# Altium schematic sheet Sheet1.SchDoc
size 840 x 594 mm; SheetTotal: 1; DocumentType: Схема электрическая принципиальная
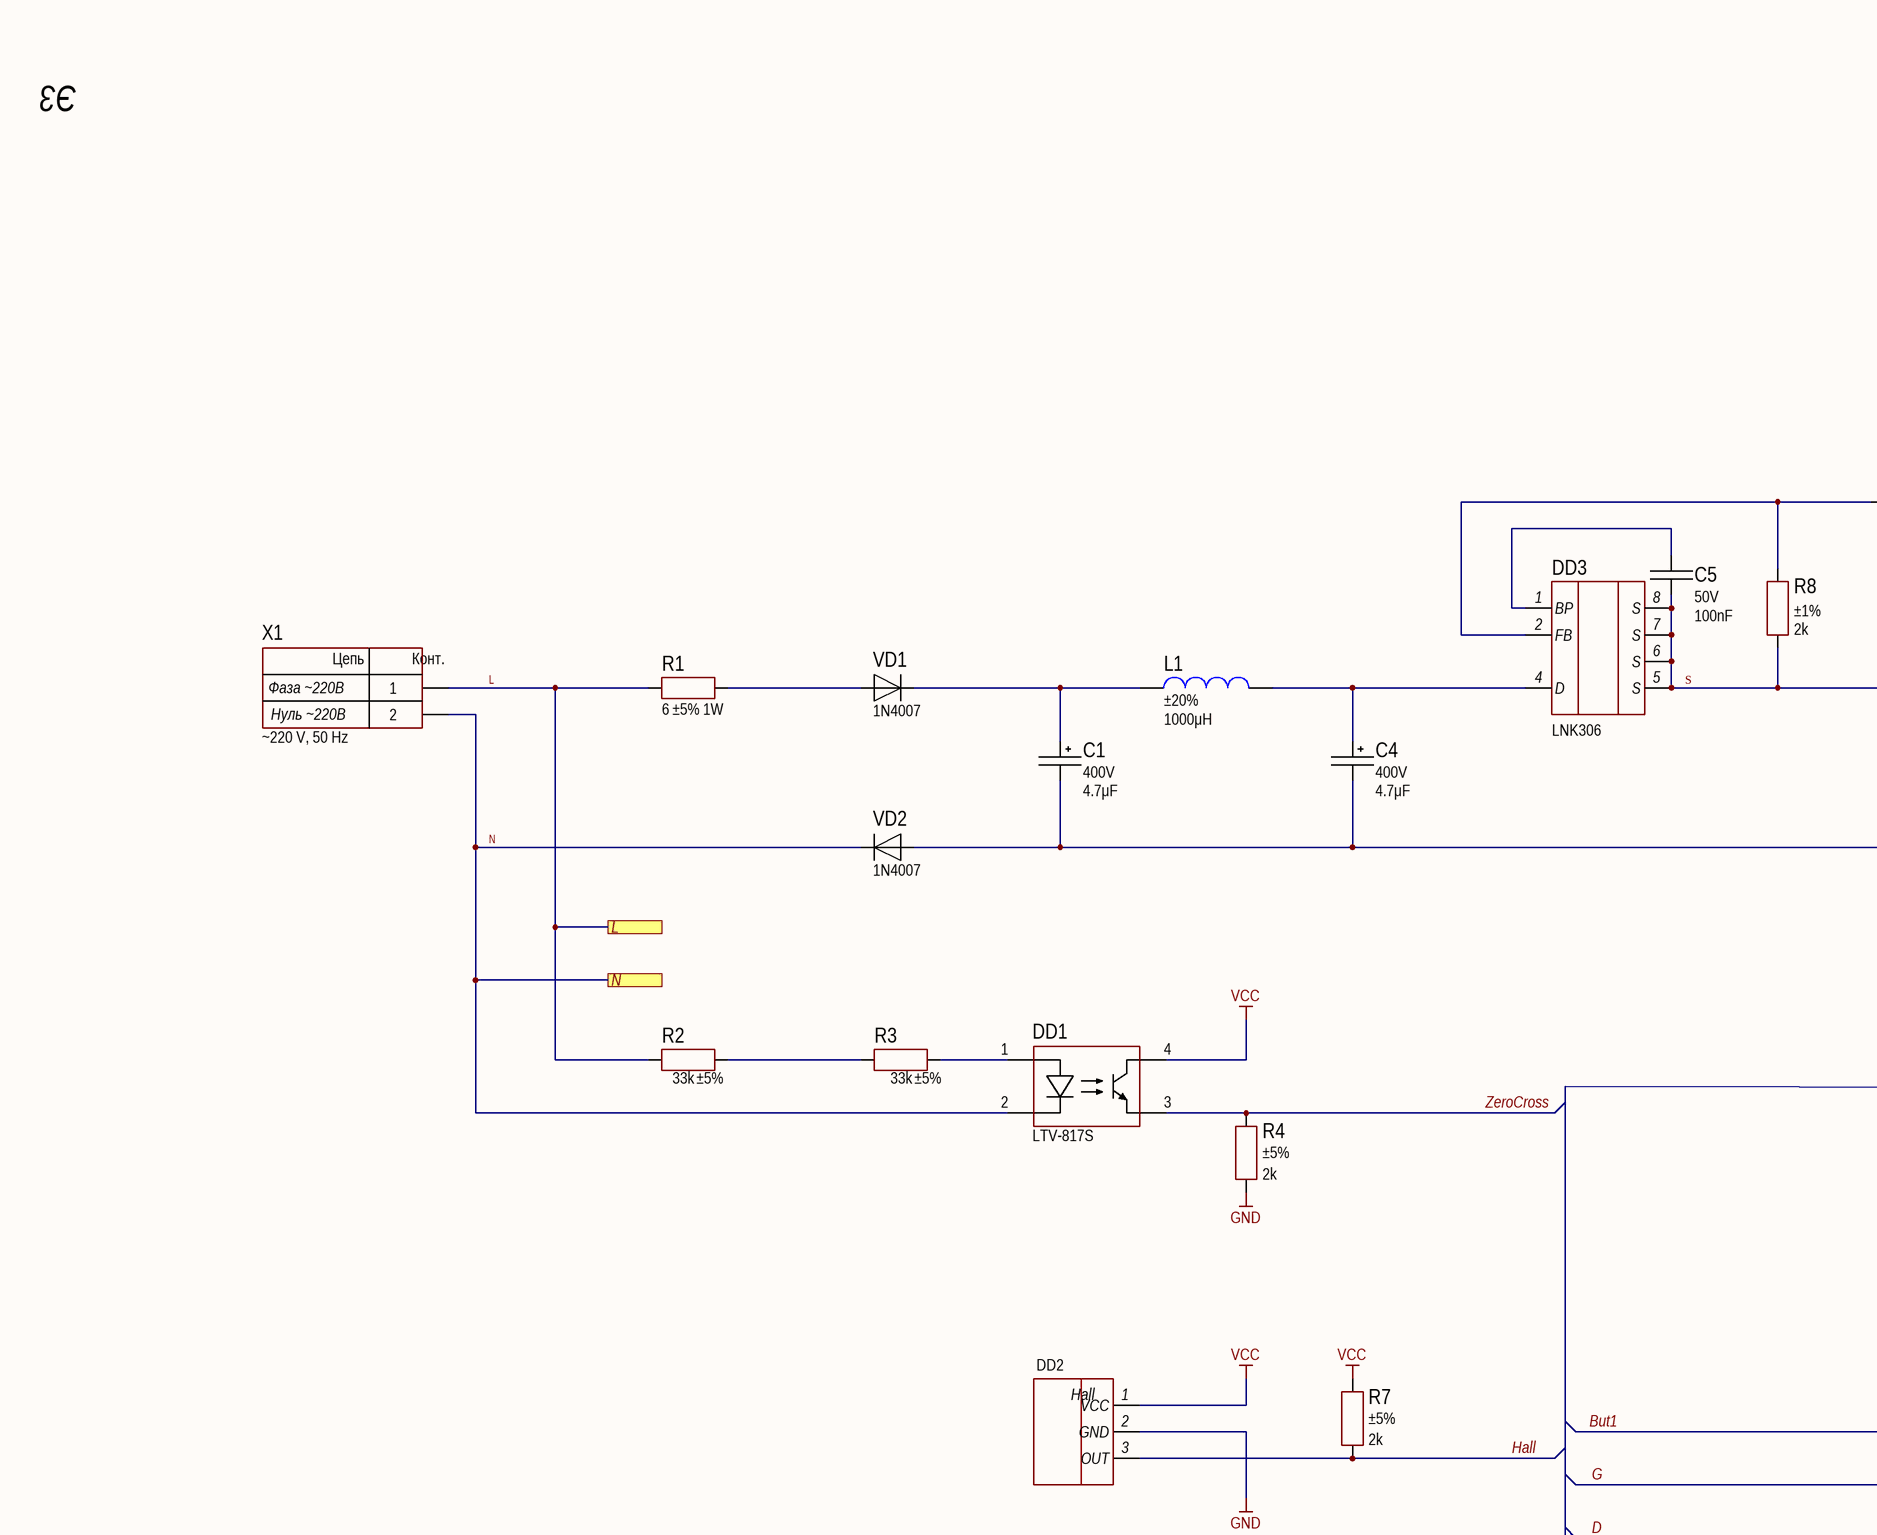
[diagram p0: Sheet1.SchDoc, top left]
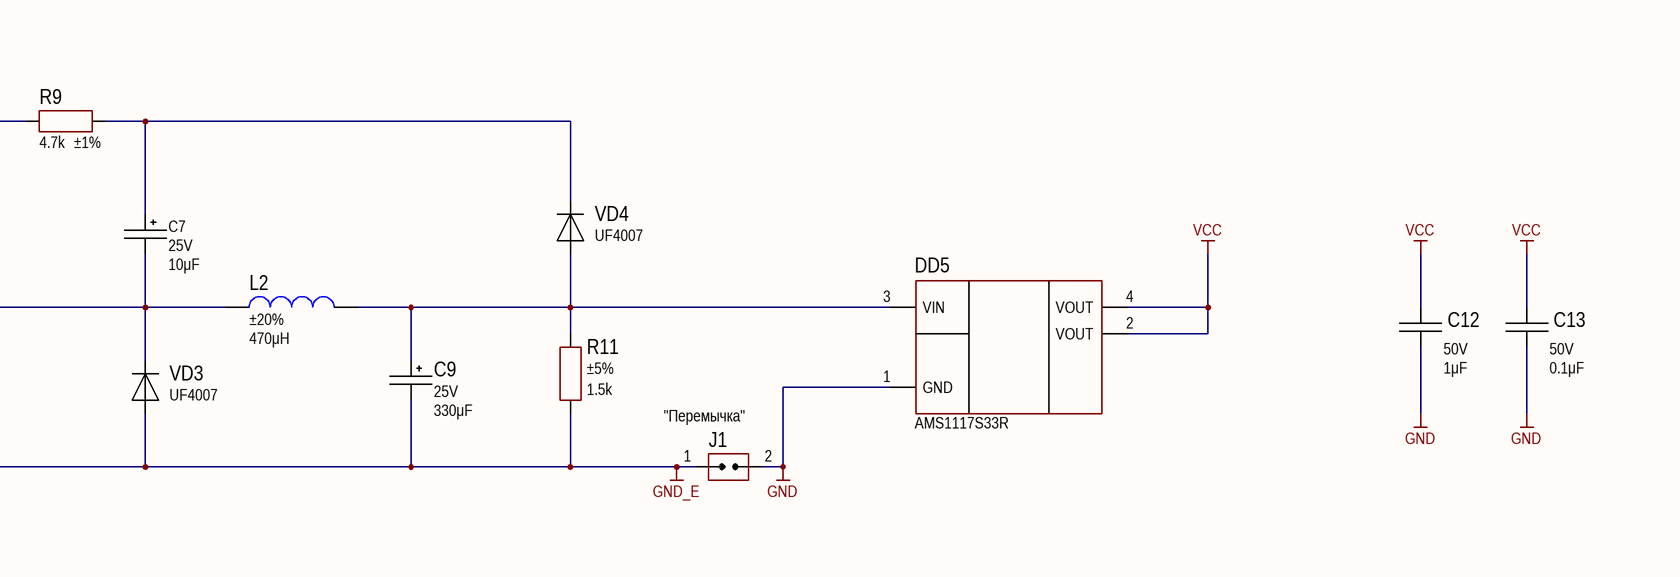
[diagram p1: Sheet1.SchDoc, top right]
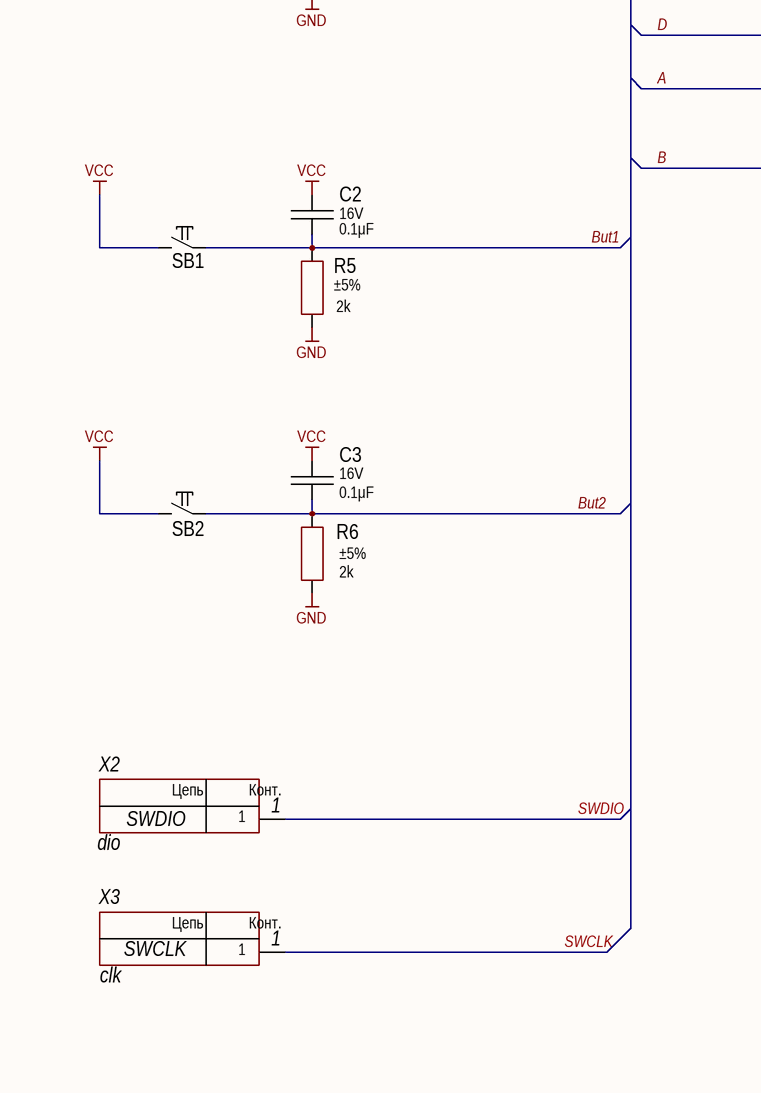
[diagram p2: Sheet1.SchDoc, bottom left]
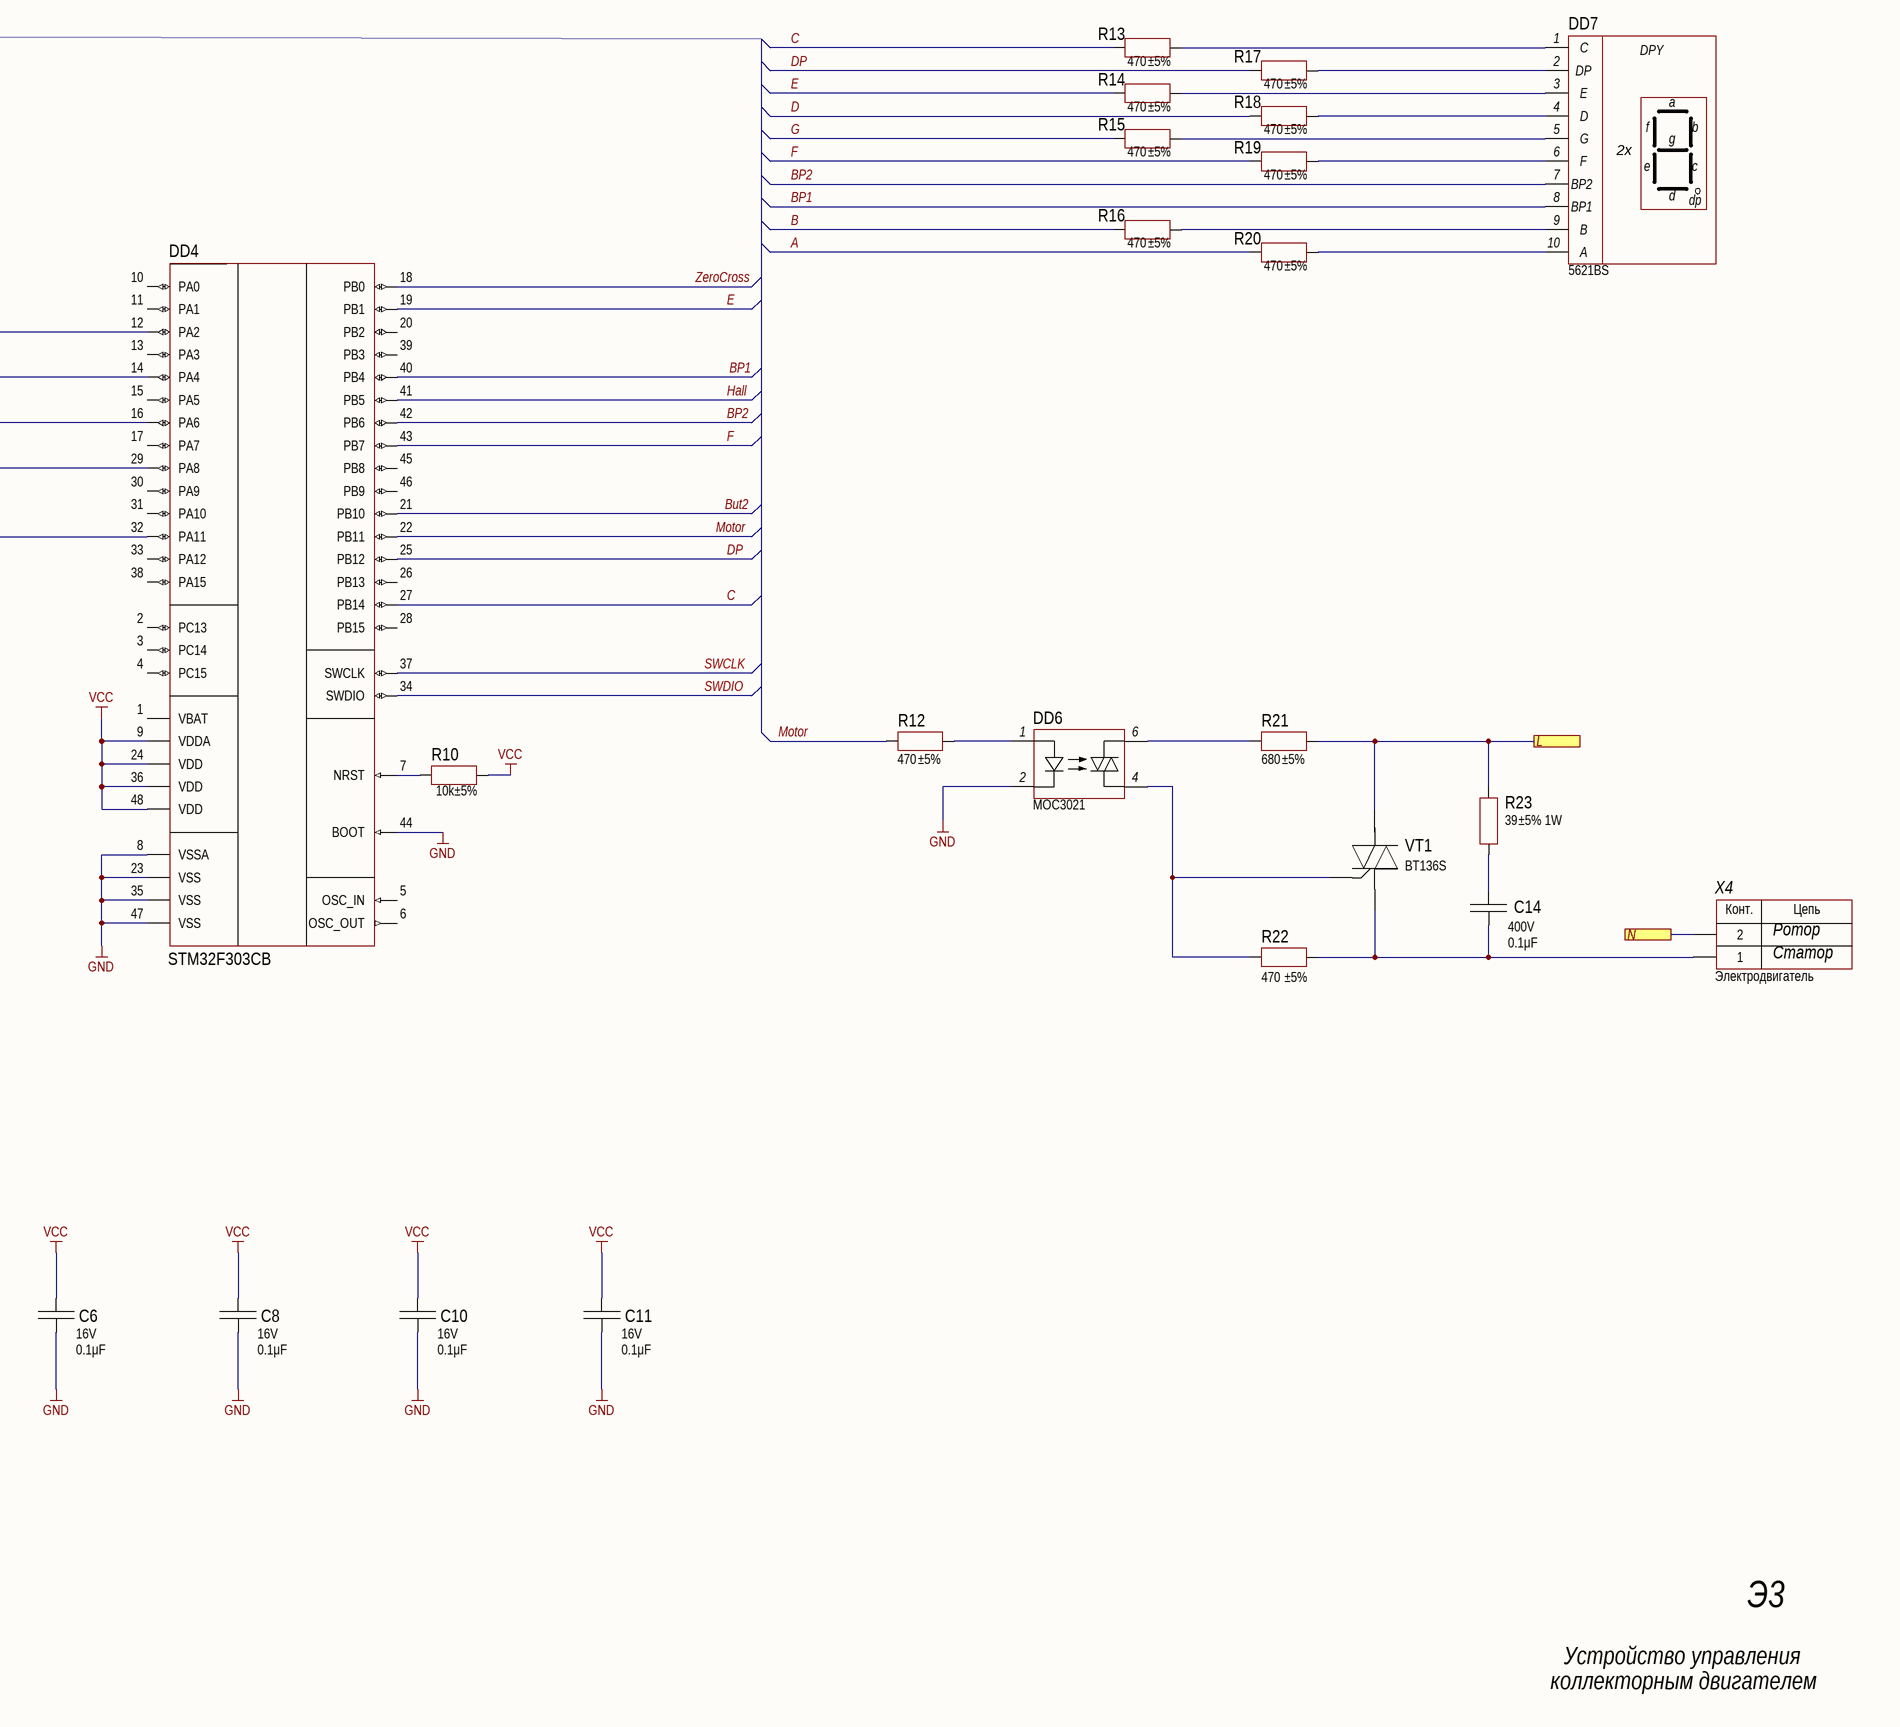
[diagram p3: Sheet1.SchDoc, bottom right]

## Parts
C1  value 4.7μF  Voltage: 400V  [CAP: D8C3.5H12]
C2  value 0.1μF  Voltage: 16V  [CAP: 0805]
C3  value 0.1μF  Voltage: 16V  [CAP: 0805]
C4  value 4.7μF  Voltage: 400V  [CAP: D8C3.5H12]
C5  value 100nF  Voltage: 50V  [CAP: 1206]
C6  value 0.1μF  Voltage: 16V  [CAP: 0805]
C7  value 10μF  Voltage: 25V  [CAP: D5C2H11]
C8  value 0.1μF  Voltage: 16V  [CAP: 0805]
C9  value 330μF  Voltage: 25V  [CAP: D10C5H12.5]
C10  value 0.1μF  Voltage: 16V  [CAP: 0805]
C11  value 0.1μF  Voltage: 16V  [CAP: 0805]
C12  value 1μF  Voltage: 50V  [CAP: 1206]
C13  value 0.1μF  Voltage: 50V  [CAP: 1206]
C14  value 0.1μF  Voltage: 400V  [CAP: B32521]
DD1  PartNumber: LTV-817S  [4-SMD]
DD2  A3144 Hall  [hall]  (value not drawn)
DD3  LNK306  [SO-8C]
DD4  PartNumber: STM32F303CB  [48-LQFP]
DD5  PartNumber: AMS1117S33R  [SOT223]
DD6  MOC3021  [SDIP-6]
DD7  5621BS  [0.56"]
J1  CommentText: "Перемычка"  [CON: JUMPER x1]
L1  value 1000μH  Tolerance: ±20%  [IND: SDR0604]
L2  value 470μH  Tolerance: ±20%  [IND: SDR0604]
R1  value 6  Tolerance: ±5% 1W  [RES: 2512]
R2  value 33k  Tolerance: ±5%  [RES: 1206]
R3  value 33k  Tolerance: ±5%  [RES: 1206]
R4  value 2k  Tolerance: ±5%  [RES: 0805]
R5  value 2k  Tolerance: ±5%  [RES: 0805]
R6  value 2k  Tolerance: ±5%  [RES: 0805]
R7  value 2k  Tolerance: ±5%  [RES: 0805]
R8  value 2k  Tolerance: ±1%  [RES: 1206]
R9  value 4.7k  Tolerance: ±1%  [RES: 1206]
R10  value 10k  Tolerance: ±5%  [RES: 0402]
R11  value 1.5k  Tolerance: ±5%  [RES: 1206]
R12  value 470  Tolerance: ±5%  [RES: 0805]
R13  value 470  Tolerance: ±5%  [RES: 0805]
R14  value 470  Tolerance: ±5%  [RES: 0805]
R15  value 470  Tolerance: ±5%  [RES: 0805]
R16  value 470  Tolerance: ±5%  [RES: 0805]
R17  value 470  Tolerance: ±5%  [RES: 0805]
R18  value 470  Tolerance: ±5%  [RES: 0805]
R19  value 470  Tolerance: ±5%  [RES: 0805]
R20  value 470  Tolerance: ±5%  [RES: 0805]
R21  value 680  Tolerance: ±5%  [RES: 1206]
R22  value 470  Tolerance: ±5%  [RES: 1206]
R23  value 39  Tolerance: ±5% 1W  [RES: 2512]
SB1  (no value)  [Button_smd 6x4]
SB2  (no value)  [Button_smd 6x4]
VD1  PartNumber: 1N4007  [DIODE: SMA]
VD2  PartNumber: 1N4007  [DIODE: SMA]
VD3  PartNumber: UF4007  [DIODE: SMA]
VD4  PartNumber: UF4007  [DIODE: SMA]
VT1  BT136S  [TO-252]
X1  CommentText: ~220 V, 50 Hz  [CON: 0395430002 (5 mm)]
X2  dio  [1-PIN]
X3  clk  [1-PIN]
X4  CommentText: Электродвигатель  [CON: 0395430002 (5 mm)]

## Ports
L, N

## Nets
GND: C6.1 C8.1 C10.1 C11.1 C12.1 C13.1 DD2.2(GND) DD4.8(VSSA) DD4.23(VSS) DD4.35(VSS) DD4.44(BOOT) DD4.47(VSS) DD5.1(GND) DD6.2(C) J1.2(IN) R4.1 R5.2 R6.1
GND_E: C1.2 C4.2 C9.2 J1.1(IN) R11.2 VD2.1 VD3.1
VCC: C2.1 C3.1 C6.2 C8.2 C10.2 C11.2 C12.2 C13.2 DD1.4(C) DD2.1(VCC) DD4.9(VDDA) DD4.24(VDD) DD4.36(VDD) DD4.48(VDD) DD5.2(VOUT) DD5.4(VOUT) R7.2 R10.2 SB1.2 SB2.2
A: DD4.29(PA8) R20.1
B: DD4.32(PA11) R16.1
BP1: DD4.40(PB4) DD7.8(BP1)
BP2: DD4.42(PB6) DD7.7(BP2)
But1: C2.2 DD4.12(PA2) R5.1 SB1.1
But2: C3.2 DD4.21(PB10) R6.2 SB2.1
C: DD4.27(PB14) R13.1
D: DD4.16(PA6) R18.1
DP: DD4.25(PB12) R17.1
E: DD4.19(PB1) R14.1
F: DD4.43(PB7) R19.1
G: DD4.14(PA4) R15.1
Hall: DD2.3(OUT) DD4.41(PB5) R7.1
L: R1.1 R2.1 R21.1 R23.2 VT1.2(T2) X1.1 ; port L
Motor: DD4.22(PB11) R12.1
N: DD1.2(C) VD2.2 X1.2 X4.2 ; port N
S: C5.1 C7.2 DD3.5(S) DD3.6(S) DD3.7(S) DD3.8(S) L2.2 R8.1 VD3.2
SWCLK: DD4.37(SWCLK) X3.1
SWDIO: DD4.34(SWDIO) X2.1
ZeroCross: DD1.3(E) DD4.18(PB0) R4.2
NetC1_1: C1.1 L1.2 VD1.2
NetC4_1: C4.1 DD3.4(D) L1.1
NetC5_2: C5.2 DD3.1(BP)
NetC7_1: C7.1 R9.2 VD4.2
NetC9_1: C9.1 DD5.3(VIN) L2.1 R11.1 VD4.1
NetC14_1: C14.1 R23.1
NetC14_2: C14.2 R22.1 VT1.1(T1) X4.1
NetDD1_1: DD1.1(A) R3.2
NetDD3_2: DD3.2(FB) R8.2 R9.1
NetDD4_7: DD4.7(NRST) R10.1
NetDD6_1: DD6.1(A) R12.2
NetDD6_4: DD6.4(OUT2) R22.2 VT1.3(G)
NetDD6_6: DD6.6(OUT1) R21.2
NetDD7_1: DD7.1(C) R13.2
NetDD7_2: DD7.2(DP) R17.2
NetDD7_3: DD7.3(E) R14.2
NetDD7_4: DD7.4(D) R18.2
NetDD7_5: DD7.5(G) R15.2
NetDD7_6: DD7.6(F) R19.2
NetDD7_9: DD7.9(B) R16.2
NetDD7_10: DD7.10(A) R20.2
NetR1_2: R1.2 VD1.1
NetR2_2: R2.2 R3.1

Not connected (* = marked no-connect by the designer): DD4 1(VBAT) 2(PC13) 3(PC14) 4(PC15) 5(OSC_IN) 6(OSC_OUT) 10(PA0) 11(PA1) 13(PA3) 15(PA5) 17(PA7) 20(PB2) 26(PB13) 28(PB15) 30(PA9) 31(PA10) 33(PA12) 38(PA15) 39(PB3) 45(PB8) 46(PB9)

## Notes on the sheet
- Э3
- Фаза ~220В
- Нуль ~220В
- Ротор
- Статор
- SWDIO
- SWCLK
- Устройство управления
- коллекторным двигателем
- Перв. примен.
- Справ. №
- Подп. и дата
- Инв. № дубл.
- Взам. инв. №
- Разраб.
- Изм.
- Лист
- № докум.
- Подп.
- Дата
- Лит.
- Масса
- Масштаб
- Пров.
- Т.контр.
- Листов
- Инв. № подл.
- Утв.
- Н.контр.
- 2.106-A1
- Копировал
- Формат А1
- (in symbol 1-PIN) Цепь; Конт.
- (in symbol 7-segment 2 digit display) DPY; a; f; b; g; 2x; e; c; d; dp
- (in symbol A3144 Hall) Hall
- (in symbol Connector_terminal_2pin) Цепь; Конт.

## Library data of the parts
C1 C4 = Aluminium: Manufacturer: Wurth; PartNumber: 860080475013; ValueManufacturerPartNumber: Aluminium capacitor, 4.7μF, 400V, ±20%, 54mOhm, 14x10x5 mm, -55...+105°C; TypeCapacitor: Aluminium capacitor; Tolerance: ±20%; Impedance: 54mOhm; Package: 14x10x5 mm; HelpURL: https://www.digikey.com/product-detail/en/wurth-electronics-inc/860080475013/732-9029-1-ND/5728972; Temperature: -55...+105°C
C2 C3 C6 C8 C10 C11 = Ceramic_0805: Manufacturer: Yageo; PartNumber: CC0805KRX7R7BB104; ValueManufacturerPartNumber: Ceramic capacitor, 0.1μF, X7R, ±10%, 16V, 0805, -55...+125°C; TypeCapacitor: Ceramic capacitor; Tolerance: ±10%; TypeDielectric: X7R; Package: 0805; HelpURL: https://www.digikey.com/product-detail/en/yageo/CC0805KRX7R7BB104/311-1142-1-ND/303052; Temperature: -55...+125°C
C5 = Ceramic_1206: Manufacturer: Yageo; PartNumber: CC1206KRX7R9BB104; ValueManufacturerPartNumber: Ceramic capacitor, 100nF, X7R, ±10%, 50V, 1206, -55...+125°C; TypeCapacitor: Ceramic capacitor; Tolerance: ±10%; TypeDielectric: X7R; Package: 1206; HelpURL: https://www.digikey.com/product-detail/en/yageo/CC1206KRX7R9BB104/311-1179-1-ND/303089; Temperature: -55...+125°C
C7 = Aluminium: Manufacturer: Wurth; PartNumber: 860080475013; ValueManufacturerPartNumber: Aluminium capacitor, 10μF, 25V, ±20%, 54mOhm, 14x10x5 mm, -55...+105°C; TypeCapacitor: Aluminium capacitor; Tolerance: ±20%; Impedance: 54mOhm; Package: 14x10x5 mm; HelpURL: https://www.digikey.com/product-detail/en/wurth-electronics-inc/860080475013/732-9029-1-ND/5728972; Temperature: -55...+105°C
C9 = Aluminium: Manufacturer: Wurth; PartNumber: 860080475013; ValueManufacturerPartNumber: Aluminium capacitor, 330μF, 25V, ±20%, 54mOhm, 14x10x5 mm, -55...+105°C; TypeCapacitor: Aluminium capacitor; Tolerance: ±20%; Impedance: 54mOhm; Package: 14x10x5 mm; HelpURL: https://www.digikey.com/product-detail/en/wurth-electronics-inc/860080475013/732-9029-1-ND/5728972; Temperature: -55...+105°C
C12 = Ceramic_1206: Manufacturer: Yageo; PartNumber: CC1206KRX7R9BB104; ValueManufacturerPartNumber: Ceramic capacitor, 1μF, X7R, ±10%, 50V, 1206, -55...+125°C; TypeCapacitor: Ceramic capacitor; Tolerance: ±10%; TypeDielectric: X7R; Package: 1206; HelpURL: https://www.digikey.com/product-detail/en/yageo/CC1206KRX7R9BB104/311-1179-1-ND/303089; Temperature: -55...+125°C
C13 = Ceramic_1206: Manufacturer: Yageo; PartNumber: CC1206KRX7R9BB104; ValueManufacturerPartNumber: Ceramic capacitor, 0.1μF, X7R, ±10%, 50V, 1206, -55...+125°C; TypeCapacitor: Ceramic capacitor; Tolerance: ±10%; TypeDielectric: X7R; Package: 1206; HelpURL: https://www.digikey.com/product-detail/en/yageo/CC1206KRX7R9BB104/311-1179-1-ND/303089; Temperature: -55...+125°C
C14 = Film: Manufacturer: Epcos; PartNumber: B32774D4106K000; ValueManufacturerPartNumber: Film capacitor, 0.1μF, 400V, ±10%, 10.9mOhm, 31.5x15 mm, -40...+105°C; TypeCapacitor: Film capacitor; Tolerance: ±10%; Impedance: 10.9mOhm; Package: 31.5x15 mm; HelpURL: https://www.digikey.com/products/en/capacitors/film-capacitors/62?k=&pkeyword=&sv=0&pv2097=1958&sf=0&FV=fffc01ef%2C1f140000%2Cffe0003e%2Cffec6366&quantity=1&ColumnSort=1000011&page=1&stock=1&pageSize=25; Temperature: -40...+105°C
DD1 = LTV-817: Optoisolator; Manufacturer: Lite-On; ValueManufacturerPartNumber: IC optoisolator, 4µs/3µs, 5000Vrms, 35V, -40...+125°C, 4-SMD; Supply: 35V; DataRate: 4µs/3µs; Isolation: 5000Vrms; HelpURL: https://www.digikey.com/product-detail/en/lite-on-inc/LTV-817S/160-1367-5-ND/385837; Package: 4-SMD; ComponentType: IC optoisolator; Temperature: -40...+125°C
DD2 = A3144 Hall: Digital Hall sensor
DD4 = STM32F103C8T6: Cortex-M3; Manufacturer: STMicroelectronics; ValueManufacturerPartNumber: IC microcontroller, 32-Bit, Cortex-M3, 72MHz, 64KB, 20KB, 2...3.6V, -40...+85°C, 48-LQFP; Supply: 2...3.6V; Speed: 72MHz; CoreSize: 32-Bit; MemoryROM: 64KB; MemoryRAM: 20KB; HelpURL: https://www.digikey.com/product-detail/en/stmicroelectronics/STM32F103C8T6TR/497-17666-1-ND/7804402; Package: 48-LQFP; ComponentType: IC microcontroller; Temperature: -40...+85°C; CoreProcessor: Cortex-M3
DD5 = LDL1117S33R: Linear voltage regulator; Manufacturer: STMicroelectronics; ValueManufacturerPartNumber: Linear voltage regulator, input 3.9...18V, 0.6V, output 3.3V, 1.2A, -40...+85°C, SOT223; VoltageInput: input 3.9...18V; MaxDropout: 0.6V; CurrentOutput: 1.2A; VoltageOutput: output 3.3V; HelpURL: https://www.digikey.com/product-detail/en/stmicroelectronics/LDL1117S33R/497-17239-1-ND/7102079; Package: SOT223; ComponentType: Linear voltage regulator; Temperature: -40...+85°C
DD6 = MOC3021_2
DD7 = 7-segment 2 digit display
J1 = Jumper_single
L1 = Inductor_SDR0604: Manufacturer: Bourns; PartNumber: SDR0604-4R7ML; ValueManufacturerPartNumber: Fixed inductor, 1000μH, ±20%, SDR0604, 1.8A, -40...+125°C; TypeInductor: Fixed inductor; MaxCurrent: 1.8A; Package: SDR0604; HelpURL: https://www.digikey.com/product-detail/en/bourns-inc/SDR0604-4R7ML/SDR0604-4R7MLCT-ND/2352942; Temperature: -40...+125°C
L2 = Inductor_SDR0604: Manufacturer: Bourns; PartNumber: SDR0604-4R7ML; ValueManufacturerPartNumber: Fixed inductor, 470μH, ±20%, SDR0604, 1.8A, -40...+125°C; TypeInductor: Fixed inductor; MaxCurrent: 1.8A; Package: SDR0604; HelpURL: https://www.digikey.com/product-detail/en/bourns-inc/SDR0604-4R7ML/SDR0604-4R7MLCT-ND/2352942; Temperature: -40...+125°C
R1 = Resistor_2512: Manufacturer: Yageo; PartNumber: RC2512JK-07100RL; ValueManufacturerPartNumber: Resistor film, 6, ±5% 1W, 2512, 1W, -55...+125°C; TypeResistor: Resistor film; Power: 1W; Package: 2512; HelpURL: https://www.digikey.com/product-detail/en/yageo/RC2512JK-07100RL/YAG3393CT-ND/5962215; Temperature: -55...+125°C
R2 R3 = Resistor_1206: Manufacturer: Yageo; PartNumber: RC1206JR-07100RL; ValueManufacturerPartNumber: Resistor film, 33k, ±5%, 1206, 0.25W, -55...+125°C; TypeResistor: Resistor film; Power: 0.25W; Package: 1206; HelpURL: https://www.digikey.com/product-detail/en/yageo/RC1206JR-07100RL/311-100ERCT-ND/732153; Temperature: -55...+125°C
R4-R7 = Resistor_0805: Manufacturer: Yageo; PartNumber: RC0805JR-07100RL; ValueManufacturerPartNumber: Resistor film, 2k, ±5%, 0805, 0.125W, -55...+125°C; TypeResistor: Resistor film; Power: 0.125W; Package: 0805; HelpURL: https://www.digikey.com/product-detail/en/yageo/RC0805JR-07100RL/311-100ARCT-ND/731185; Temperature: -55...+125°C
R8 = Resistor_1206: Manufacturer: Yageo; PartNumber: RC1206JR-07100RL; ValueManufacturerPartNumber: Resistor film, 2k, ±1%, 1206, 0.25W, -55...+125°C; TypeResistor: Resistor film; Power: 0.25W; Package: 1206; HelpURL: https://www.digikey.com/product-detail/en/yageo/RC1206JR-07100RL/311-100ERCT-ND/732153; Temperature: -55...+125°C
R9 = Resistor_1206: Manufacturer: Yageo; PartNumber: RC1206JR-07100RL; ValueManufacturerPartNumber: Resistor film, 4.7k, ±1%, 1206, 0.25W, -55...+125°C; TypeResistor: Resistor film; Power: 0.25W; Package: 1206; HelpURL: https://www.digikey.com/product-detail/en/yageo/RC1206JR-07100RL/311-100ERCT-ND/732153; Temperature: -55...+125°C
R10 = Resistor_0402: Manufacturer: Yageo; PartNumber: RC0402JR-07100RL; ValueManufacturerPartNumber: Resistor film, 10k, ±5%, 0402, 0.063W, -55...+125°C; TypeResistor: Resistor film; Power: 0.063W; Package: 0402; HelpURL: https://www.digikey.com/product-detail/en/yageo/RC0402JR-07100RL/311-100JRCT-ND/729362; Temperature: -55...+125°C
R11 = Resistor_1206: Manufacturer: Yageo; PartNumber: RC1206JR-07100RL; ValueManufacturerPartNumber: Resistor film, 1.5k, ±5%, 1206, 0.25W, -55...+125°C; TypeResistor: Resistor film; Power: 0.25W; Package: 1206; HelpURL: https://www.digikey.com/product-detail/en/yageo/RC1206JR-07100RL/311-100ERCT-ND/732153; Temperature: -55...+125°C
R12-R20 = Resistor_0805: Manufacturer: Yageo; PartNumber: RC0805JR-07100RL; ValueManufacturerPartNumber: Resistor film, 470, ±5%, 0805, 0.125W, -55...+125°C; TypeResistor: Resistor film; Power: 0.125W; Package: 0805; HelpURL: https://www.digikey.com/product-detail/en/yageo/RC0805JR-07100RL/311-100ARCT-ND/731185; Temperature: -55...+125°C
R21 = Resistor_1206: Manufacturer: Yageo; PartNumber: RC1206JR-07100RL; ValueManufacturerPartNumber: Resistor film, 680, ±5%, 1206, 0.25W, -55...+125°C; TypeResistor: Resistor film; Power: 0.25W; Package: 1206; HelpURL: https://www.digikey.com/product-detail/en/yageo/RC1206JR-07100RL/311-100ERCT-ND/732153; Temperature: -55...+125°C
R22 = Resistor_1206: Manufacturer: Yageo; PartNumber: RC1206JR-07100RL; ValueManufacturerPartNumber: Resistor film, 470, ±5%, 1206, 0.25W, -55...+125°C; TypeResistor: Resistor film; Power: 0.25W; Package: 1206; HelpURL: https://www.digikey.com/product-detail/en/yageo/RC1206JR-07100RL/311-100ERCT-ND/732153; Temperature: -55...+125°C
R23 = Resistor_2512: Manufacturer: Yageo; PartNumber: RC2512JK-07100RL; ValueManufacturerPartNumber: Resistor film, 39, ±5% 1W, 2512, 1W, -55...+125°C; TypeResistor: Resistor film; Power: 1W; Package: 2512; HelpURL: https://www.digikey.com/product-detail/en/yageo/RC2512JK-07100RL/YAG3393CT-ND/5962215; Temperature: -55...+125°C
SB1 SB2 = Button_tactile: Manufacturer: TE Connectivity; ValueManufacturerPartNumber: Tactile button, 6x6mm; PartNumber: FSM2JSMAATR; TypeButton: Tactile button; CommentText: "Кнопка"; HelpURL: https://www.digikey.com/product-detail/en/te-connectivity-alcoswitch-switches/FSM2JSMAATR/450-1792-1-ND/3503931; Package: 6x6mm
VD1-VD4 = Diode_single: Manufacturer: Micro Commercial; ValueManufacturerPartNumber: Single diode, 75V, 150mA, 1V, 4ns, SOD-323, -55...+150°C; TypeDiode: Single diode; Voltage: 75V; Current: 150mA; VoltageDrop: 1V; RecoveryTime: 4ns; Package: SOD-323; HelpURL: https://www.digikey.com/product-detail/en/micro-commercial-co/1N4148WX-TP/1N4148WXTPMSCT-ND/717312; Temperature: -55...+150°C
VT1 = BTA136: Triac
X1 X4 = Connector_terminal_2pin: Manufacturer: Degson; ValueManufacturerPartNumber: Terminal connector, 2pin, 3.5mm, 300VAC, 10A; PartNumber: DG350-3.5-02P-14; TypeConnector: Terminal connector; VoltageMax: 300VAC; Pitch: 3.5mm; CurrentMax: 10A; Multichannel: 2pin; HelpURL: https://www.chipdip.ru/product/dg350-3.5-02p-12
X2 X3 = 1-PIN